# Altium schematic sheet TopLevel.SchDoc
size 508 x 304 mm; DrawnBy: Constanza Barriga; SheetNumber: 1; SheetTotal: 10
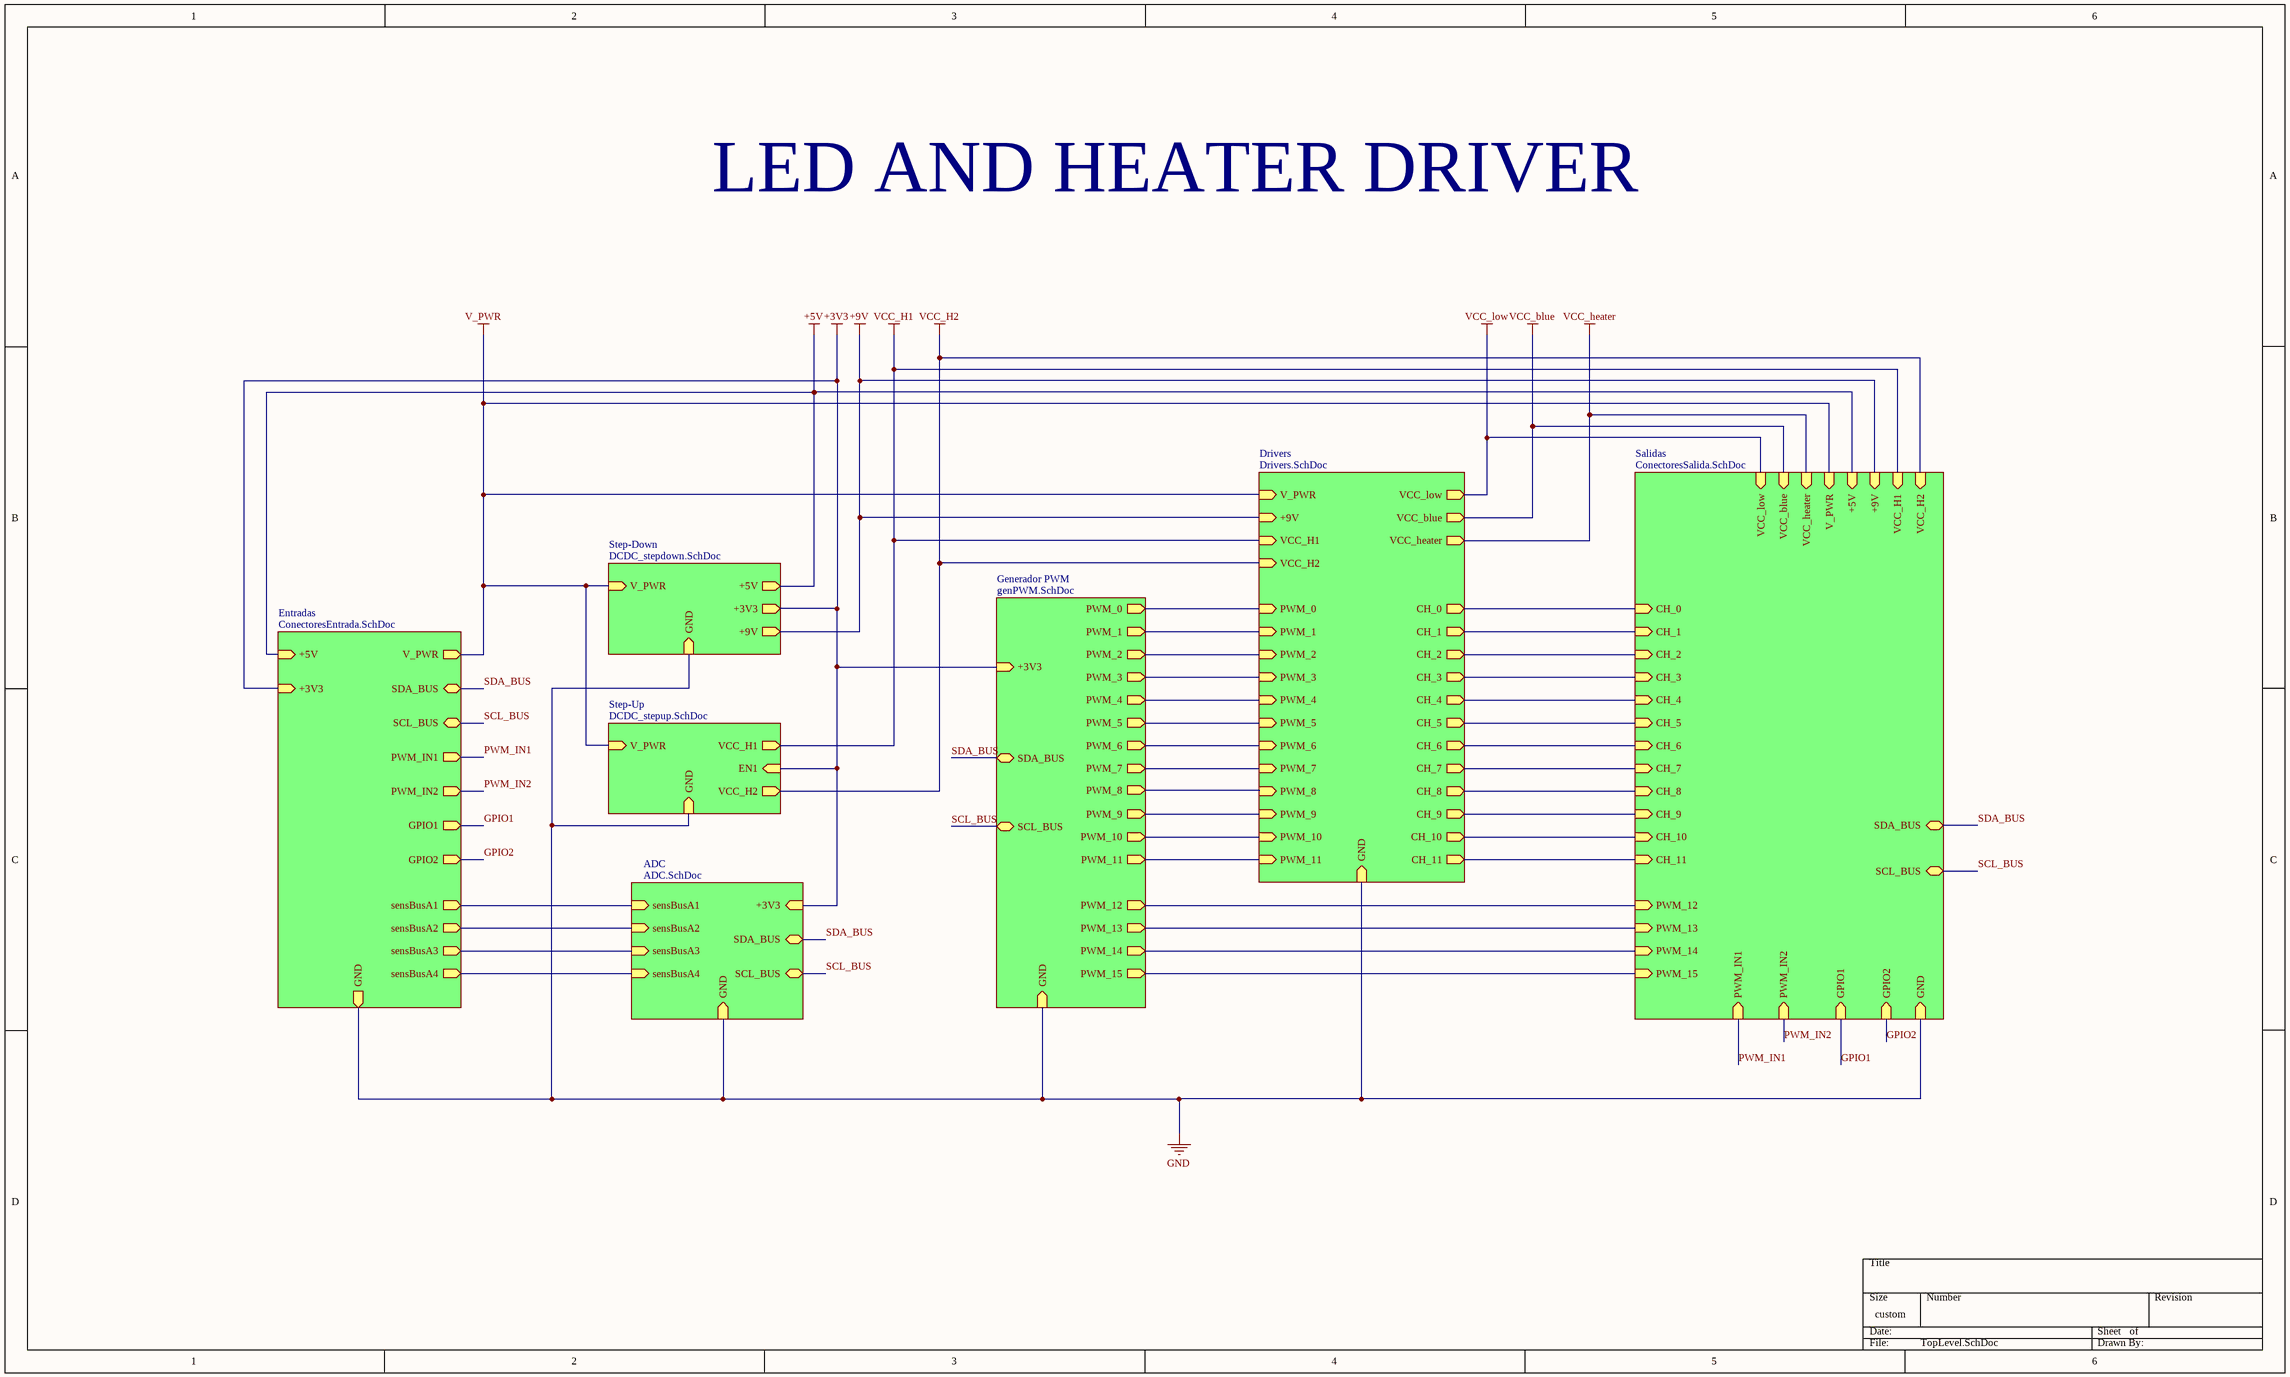
[diagram p0: TopLevel.SchDoc]

## Sub-sheets
ADC = ADC.SchDoc: +3V3 (in), sensBusA1 (in), GND (in), SDA_BUS (bidir), SCL_BUS (bidir), sensBusA2 (in), sensBusA3 (in), sensBusA4 (in)
Drivers = Drivers.SchDoc: GND (in), PWM_11 (in), PWM_10 (in), PWM_9 (in), PWM_8 (in), PWM_7 (in), PWM_6 (in), PWM_5 (in), PWM_4 (in), PWM_3 (in), PWM_2 (in), PWM_1 (in), PWM_0 (in), VCC_H2 (in), VCC_H1 (in), +9V (in), V_PWR (in), VCC_low (out), VCC_blue (out), VCC_heater (out), CH_0 (out), CH_1 (out), CH_2 (out), CH_3 (out), CH_4 (out), CH_5 (out), CH_6 (out), CH_7 (out), CH_8 (out), CH_9 (out), CH_10 (out), CH_11 (out)
Entradas = ConectoresEntrada.SchDoc: SDA_BUS (bidir), SCL_BUS (bidir), PWM_IN1 (out), PWM_IN2 (out), GPIO1 (out), GPIO2 (out), V_PWR (out), GND (out), +5V (in), +3V3 (in), sensBusA1 (out), sensBusA2 (out), sensBusA3 (out), sensBusA4 (out)
Generador PWM = genPWM.SchDoc: PWM_0 (out), PWM_1 (out), PWM_2 (out), PWM_3 (out), PWM_4 (out), PWM_5 (out), PWM_6 (out), PWM_7 (out), PWM_8 (out), PWM_9 (out), PWM_10 (out), PWM_11 (out), PWM_12 (out), PWM_13 (out), PWM_14 (out), PWM_15 (out), +3V3 (in), SDA_BUS (bidir), SCL_BUS (bidir), GND (in)
Salidas = ConectoresSalida.SchDoc: VCC_low (in), VCC_blue (in), VCC_heater (in), V_PWR (in), +5V (in), +9V (in), VCC_H1 (in), VCC_H2 (in), CH_0 (in), CH_1 (in), CH_2 (in), CH_3 (in), CH_4 (in), CH_5 (in), CH_6 (in), CH_7 (in), CH_8 (in), CH_9 (in), CH_10 (in), CH_11 (in), PWM_12 (in), PWM_13 (in), PWM_14 (in), PWM_15 (in), PWM_IN1 (in), PWM_IN2 (in), GPIO1 (in), GPIO2 (in), GND (in), SCL_BUS (bidir), SDA_BUS (bidir)
Step-Down = DCDC_stepdown.SchDoc: V_PWR (in), GND (in), +5V (out), +3V3 (out), +9V (out)
Step-Up = DCDC_stepup.SchDoc: V_PWR (in), EN1 (in), GND (in), VCC_H1 (out), VCC_H2 (out)

## Nets
+3V3: sheet Entradas/+3V3, sheet Step-Down/+3V3, sheet Step-Up/EN1, sheet Generador PWM/+3V3, sheet ADC/+3V3
+5V: sheet Entradas/+5V, sheet Step-Down/+5V, sheet Salidas/+5V
+9V: sheet Step-Down/+9V, sheet Drivers/+9V, sheet Salidas/+9V
GND: sheet Entradas/GND, sheet Step-Down/GND, sheet Step-Up/GND, sheet Generador PWM/GND, sheet ADC/GND, sheet Drivers/GND, sheet Salidas/GND
V_PWR: sheet Entradas/V_PWR, sheet Step-Down/V_PWR, sheet Step-Up/V_PWR, sheet Drivers/V_PWR, sheet Salidas/V_PWR
VCC_blue: sheet Drivers/VCC_blue, sheet Salidas/VCC_blue
VCC_H1: sheet Step-Up/VCC_H1, sheet Drivers/VCC_H1, sheet Salidas/VCC_H1
VCC_H2: sheet Step-Up/VCC_H2, sheet Drivers/VCC_H2, sheet Salidas/VCC_H2
VCC_heater: sheet Drivers/VCC_heater, sheet Salidas/VCC_heater
VCC_low: sheet Drivers/VCC_low, sheet Salidas/VCC_low
GPIO1: sheet Entradas/GPIO1, sheet Salidas/GPIO1
GPIO2: sheet Entradas/GPIO2, sheet Salidas/GPIO2
PWM_IN1: sheet Entradas/PWM_IN1, sheet Salidas/PWM_IN1
PWM_IN2: sheet Entradas/PWM_IN2, sheet Salidas/PWM_IN2
SCL_BUS: sheet Entradas/SCL_BUS, sheet Generador PWM/SCL_BUS, sheet ADC/SCL_BUS, sheet Salidas/SCL_BUS
SDA_BUS: sheet Entradas/SDA_BUS, sheet Generador PWM/SDA_BUS, sheet ADC/SDA_BUS, sheet Salidas/SDA_BUS
(unnamed): sheet Entradas/sensBusA1, sheet ADC/sensBusA1
(unnamed): sheet Entradas/sensBusA2, sheet ADC/sensBusA2
(unnamed): sheet Entradas/sensBusA3, sheet ADC/sensBusA3
(unnamed): sheet Entradas/sensBusA4, sheet ADC/sensBusA4
(unnamed): sheet Generador PWM/PWM_0, sheet Drivers/PWM_0
(unnamed): sheet Generador PWM/PWM_1, sheet Drivers/PWM_1
(unnamed): sheet Generador PWM/PWM_2, sheet Drivers/PWM_2
(unnamed): sheet Generador PWM/PWM_3, sheet Drivers/PWM_3
(unnamed): sheet Generador PWM/PWM_4, sheet Drivers/PWM_4
(unnamed): sheet Generador PWM/PWM_5, sheet Drivers/PWM_5
(unnamed): sheet Generador PWM/PWM_6, sheet Drivers/PWM_6
(unnamed): sheet Generador PWM/PWM_7, sheet Drivers/PWM_7
(unnamed): sheet Generador PWM/PWM_8, sheet Drivers/PWM_8
(unnamed): sheet Generador PWM/PWM_9, sheet Drivers/PWM_9
(unnamed): sheet Generador PWM/PWM_10, sheet Drivers/PWM_10
(unnamed): sheet Generador PWM/PWM_11, sheet Drivers/PWM_11
(unnamed): sheet Generador PWM/PWM_12, sheet Salidas/PWM_12
(unnamed): sheet Generador PWM/PWM_13, sheet Salidas/PWM_13
(unnamed): sheet Generador PWM/PWM_14, sheet Salidas/PWM_14
(unnamed): sheet Generador PWM/PWM_15, sheet Salidas/PWM_15
(unnamed): sheet Drivers/CH_0, sheet Salidas/CH_0
(unnamed): sheet Drivers/CH_1, sheet Salidas/CH_1
(unnamed): sheet Drivers/CH_2, sheet Salidas/CH_2
(unnamed): sheet Drivers/CH_3, sheet Salidas/CH_3
(unnamed): sheet Drivers/CH_4, sheet Salidas/CH_4
(unnamed): sheet Drivers/CH_5, sheet Salidas/CH_5
(unnamed): sheet Drivers/CH_6, sheet Salidas/CH_6
(unnamed): sheet Drivers/CH_7, sheet Salidas/CH_7
(unnamed): sheet Drivers/CH_8, sheet Salidas/CH_8
(unnamed): sheet Drivers/CH_9, sheet Salidas/CH_9
(unnamed): sheet Drivers/CH_10, sheet Salidas/CH_10
(unnamed): sheet Drivers/CH_11, sheet Salidas/CH_11

## Notes on the sheet
- LED AND HEATER DRIVER